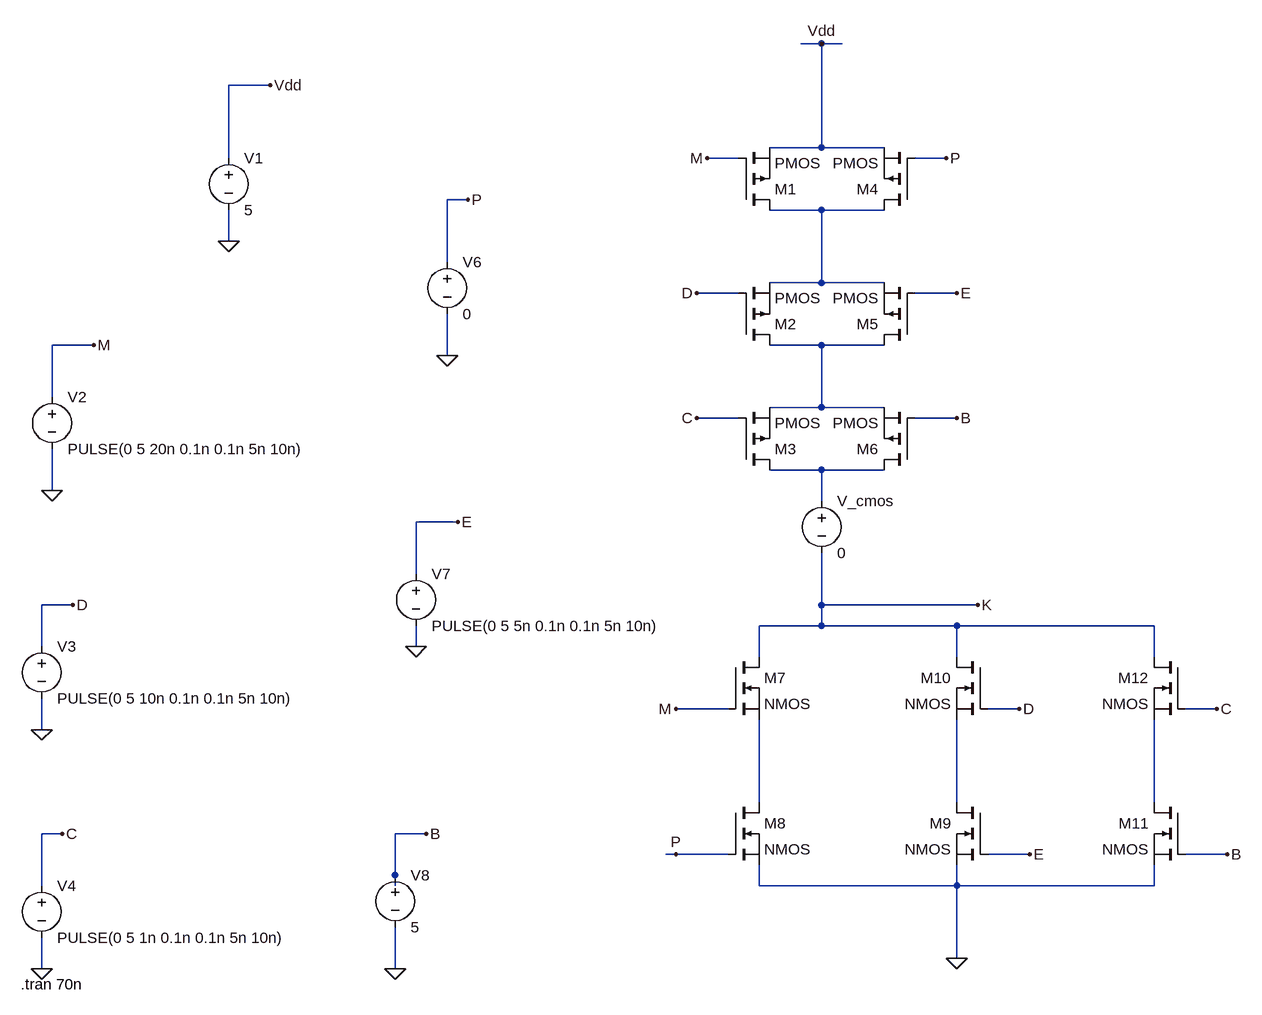
[diagram p0: schematic 5_1_1.asc]
5_1_1.asc, the LTspice schematic file:
Version 4
SHEET 1 920 1520
WIRE 240 -176 208 -176
WIRE 272 -176 240 -176
WIRE -608 -112 -672 -112
WIRE 240 -16 240 -176
WIRE 240 -16 160 -16
WIRE 336 -16 240 -16
WIRE -672 0 -672 -112
WIRE 112 0 64 0
WIRE 432 0 384 0
WIRE -304 64 -336 64
WIRE 240 80 160 80
WIRE 336 80 240 80
WIRE -672 128 -672 80
WIRE -336 160 -336 64
WIRE 240 192 240 80
WIRE 240 192 160 192
WIRE 336 192 240 192
WIRE 112 208 48 208
WIRE 448 208 384 208
WIRE -880 288 -944 288
WIRE 240 288 160 288
WIRE 336 288 240 288
WIRE -336 304 -336 240
WIRE -944 368 -944 288
WIRE 240 384 240 288
WIRE 240 384 160 384
WIRE 336 384 240 384
WIRE 112 400 48 400
WIRE 448 400 384 400
WIRE 240 480 160 480
WIRE 336 480 240 480
WIRE -944 512 -944 448
WIRE 240 528 240 480
WIRE -320 560 -384 560
WIRE -384 640 -384 560
WIRE -912 688 -960 688
WIRE 240 688 240 608
WIRE 480 688 240 688
WIRE 240 720 240 688
WIRE 240 720 144 720
WIRE 448 720 240 720
WIRE 752 720 448 720
WIRE -960 752 -960 688
WIRE -384 752 -384 720
WIRE 144 768 144 720
WIRE 448 768 448 720
WIRE 752 768 752 720
WIRE 96 848 16 848
WIRE 544 848 496 848
WIRE 848 848 800 848
WIRE -960 880 -960 832
WIRE 144 992 144 864
WIRE 448 992 448 864
WIRE 752 992 752 864
WIRE -928 1040 -960 1040
WIRE -368 1040 -416 1040
WIRE 16 1072 0 1072
WIRE 96 1072 16 1072
WIRE 560 1072 496 1072
WIRE 864 1072 800 1072
WIRE -416 1104 -416 1040
WIRE -960 1120 -960 1040
WIRE -416 1120 -416 1104
WIRE 144 1120 144 1088
WIRE 448 1120 448 1088
WIRE 448 1120 144 1120
WIRE 752 1120 752 1088
WIRE 752 1120 448 1120
WIRE 448 1232 448 1120
WIRE -960 1248 -960 1200
WIRE -416 1248 -416 1184
FLAG 448 1232 0
FLAG 480 688 Κ
FLAG 16 848 Μ
FLAG 64 0 Μ
FLAG 432 0 P
FLAG 16 1072 P
FLAG 48 208 D
FLAG 544 848 D
FLAG 448 208 E
FLAG 560 1072 E
FLAG 48 400 C
FLAG 848 848 C
FLAG 448 400 B
FLAG 864 1072 B
FLAG 240 -176 Vdd
FLAG -608 -112 Vdd
FLAG -672 128 0
FLAG -880 288 M
FLAG -304 64 P
FLAG -912 688 D
FLAG -320 560 E
FLAG -928 1040 C
FLAG -368 1040 B
FLAG -960 1248 0
FLAG -416 1248 0
FLAG -384 752 0
FLAG -960 880 0
FLAG -944 512 0
FLAG -336 304 0
SYMBOL pmos 112 80 M180
SYMATTR InstName M1
SYMBOL pmos 112 288 M180
SYMATTR InstName M2
SYMBOL pmos 112 480 M180
SYMATTR InstName M3
SYMBOL pmos 384 80 R180
SYMATTR InstName M4
SYMBOL pmos 384 288 R180
SYMATTR InstName M5
SYMBOL pmos 384 480 R180
SYMATTR InstName M6
SYMBOL nmos 96 768 R0
SYMATTR InstName M7
SYMBOL nmos 96 992 R0
SYMATTR InstName M8
SYMBOL nmos 496 992 M0
SYMATTR InstName M9
SYMBOL nmos 496 768 M0
SYMATTR InstName M10
SYMBOL nmos 800 992 M0
SYMATTR InstName M11
SYMBOL nmos 800 768 M0
SYMATTR InstName M12
SYMBOL voltage -672 -16 R0
WINDOW 123 0 0 Left 0
WINDOW 39 0 0 Left 0
SYMATTR InstName V1
SYMATTR Value 5
SYMBOL voltage -944 352 R0
WINDOW 123 0 0 Left 0
WINDOW 39 0 0 Left 0
SYMATTR InstName V2
SYMATTR Value PULSE(0 5 20n 0.1n 0.1n 5n 10n)
SYMBOL voltage -960 736 R0
WINDOW 123 0 0 Left 0
WINDOW 39 0 0 Left 0
SYMATTR InstName V3
SYMATTR Value PULSE(0 5 10n 0.1n 0.1n 5n 10n)
SYMBOL voltage -960 1104 R0
WINDOW 123 0 0 Left 0
WINDOW 39 0 0 Left 0
SYMATTR InstName V4
SYMATTR Value PULSE(0 5 1n 0.1n 0.1n 5n 10n)
SYMBOL voltage -336 144 R0
WINDOW 123 0 0 Left 0
WINDOW 39 0 0 Left 0
SYMATTR InstName V6
SYMATTR Value 0
SYMBOL voltage -384 624 R0
WINDOW 123 0 0 Left 0
WINDOW 39 0 0 Left 0
SYMATTR InstName V7
SYMATTR Value PULSE(0 5 5n 0.1n 0.1n 5n 10n)
SYMBOL voltage -416 1088 R0
WINDOW 123 0 0 Left 0
WINDOW 39 0 0 Left 0
SYMATTR InstName V8
SYMATTR Value 5
SYMBOL voltage 240 512 R0
SYMATTR InstName V_cmos
SYMATTR Value 0
TEXT -992 1272 Left 2 !.tran 70n

The netlist it stands for:
* 5_1_1.asc
M1 N001 Μ Vdd Vdd PMOS
M2 N002 D N001 N001 PMOS
M3 N003 C N002 N002 PMOS
M4 N001 P Vdd Vdd PMOS
M5 N002 E N001 N001 PMOS
M6 N003 B N002 N002 PMOS
M7 Κ Μ N004 N004 NMOS
M8 N004 P 0 0 NMOS
M9 N005 E 0 0 NMOS
M10 Κ D N005 N005 NMOS
M11 N006 B 0 0 NMOS
M12 Κ C N006 N006 NMOS
V1 Vdd 0 5
V2 M 0 PULSE(0 5 20n 0.1n 0.1n 5n 10n)
V3 D 0 PULSE(0 5 10n 0.1n 0.1n 5n 10n)
V4 C 0 PULSE(0 5 1n 0.1n 0.1n 5n 10n)
V6 P 0 0
V7 E 0 PULSE(0 5 5n 0.1n 0.1n 5n 10n)
V8 B 0 5
V_cmos N003 Κ 0
.model NMOS NMOS
.model PMOS PMOS
.lib standard.mos
.tran 70n
.backanno
.end